# EAGLE schematic UPS (EAGLE 9.4.2)
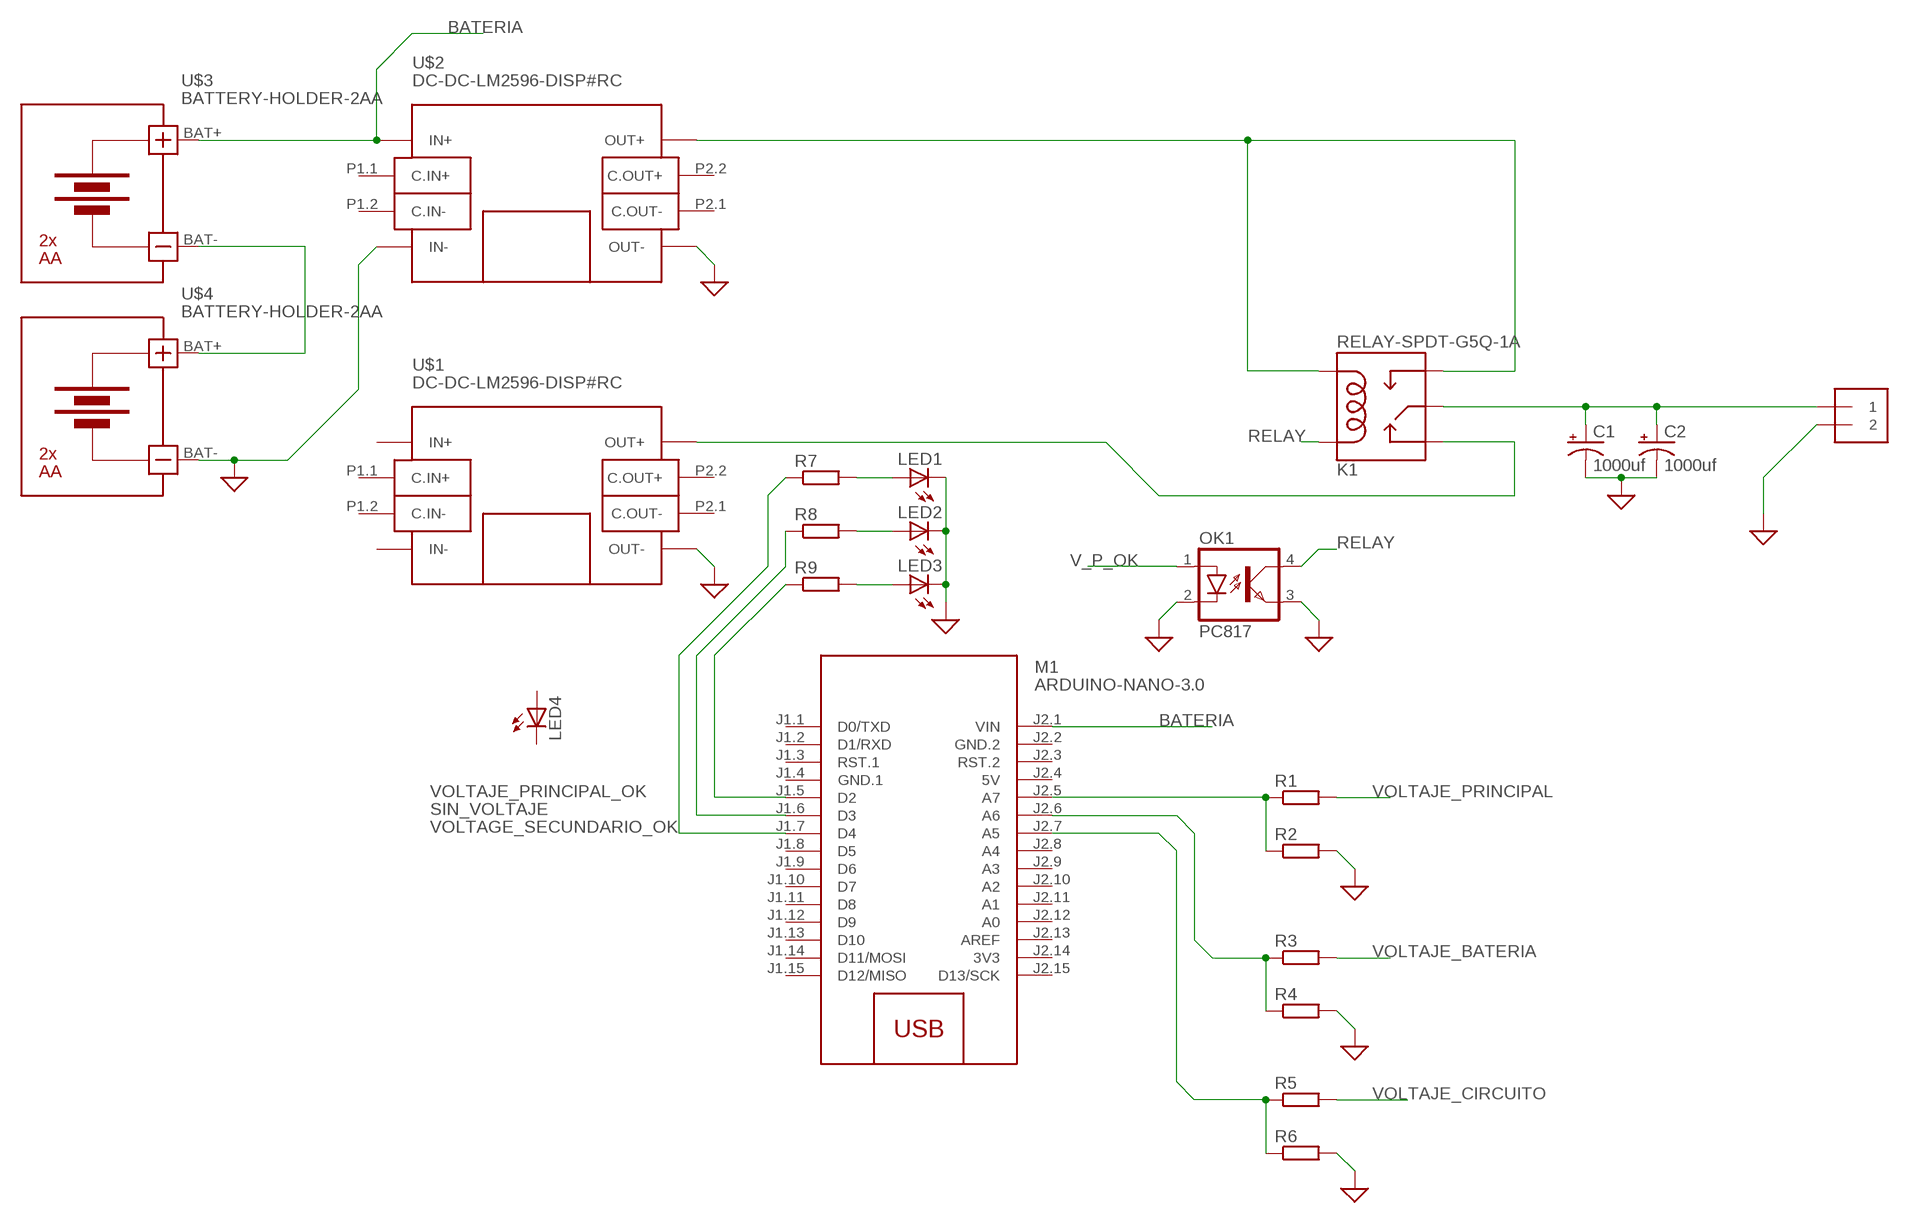
[diagram p0: schematic, sheet 1]

## Parts
C1  1000uf  1000UF-RADIAL-5MM-25V-20%  [CPOL-RADIAL-5MM-10MM]
C2  1000uf  1000UF-RADIAL-5MM-25V-20%  [CPOL-RADIAL-5MM-10MM]
J1  1X2-3.5MM  [1X2-3.5MM]
K1  RELAY-SPDT-G5Q-1A  [RELAY-G5Q]
LED1  LED5MM  [LED5MM]
LED2  LED5MM  [LED5MM]
LED3  LED5MM  [LED5MM]
LED4  LED5MM  [LED5MM]
M1  ARDUINO-NANO-3.0  [ARDUINO-NANO-3.0]
OK1  PC817  [DIL04]
R1  R-EU_0207/10  [0207/10]
R2  R-EU_0207/10  [0207/10]
R3  R-EU_0207/10  [0207/10]
R4  R-EU_0207/10  [0207/10]
R5  R-EU_0207/10  [0207/10]
R6  R-EU_0207/10  [0207/10]
R7  R-EU_0207/10  [0207/10]
R8  R-EU_0207/10  [0207/10]
R9  R-EU_0207/10  [0207/10]
U$1  DC-DC-LM2596-DISP#RC  [DC-DC-LM2596-DISP#RC]
U$2  DC-DC-LM2596-DISP#RC  [DC-DC-LM2596-DISP#RC]
U$3  BATTERY-HOLDER-2AA  [BATTERY-HOLDER-2AA]
U$4  BATTERY-HOLDER-2AA  [BATTERY-HOLDER-2AA]

## Nets
BATERIA: M1.J2.1(VIN) U$2.IN+ U$3.BAT+
GND: C1.- C2.- J1.2 LED1.K(C) LED2.K(C) LED3.K(C) OK1.2(C) OK1.3(EMIT) R2.2 R4.2 R6.2 U$1.OUT- U$2.IN- U$2.OUT- U$4.BAT- ; supply symbol labelled SUP
N$1: M1.J2.5(A7) R1.1 R2.1
N$2: M1.J2.6(A6) R3.1 R4.1
N$3: M1.J2.7(A5) R5.1 R6.1
N$4: U$3.BAT- U$4.BAT+
N$5: K1.4(NC) U$1.OUT+
N$6: C1.+ C2.+ J1.1 K1.2(MAIN)
N$8: LED1.A R7.2
N$9: LED2.A R8.2
N$10: LED3.A R9.2
N$11: K1.1(COIL2) K1.3(NO) U$2.OUT+
RELAY: K1.5(COIL1) OK1.4(COL)
SIN_VOLTAJE: M1.J1.6(D3) R8.1
V_P_OK: OK1.1(A)
VOLTAGE_SECUNDARIO_OK: M1.J1.7(D4) R7.1
VOLTAJE_BATERIA: R3.2
VOLTAJE_CIRCUITO: R5.2
VOLTAJE_PRINCIPAL: R1.2
VOLTAJE_PRINCIPAL_OK: M1.J1.5(D2) R9.1
Unconnected: LED4.A LED4.K(C) M1.J1.1(D0/TXD) M1.J1.2(D1/RXD) M1.J1.3(RST.1) M1.J1.8(D5) M1.J1.9(D6) M1.J1.10(D7) M1.J1.11(D8) M1.J1.12(D9) M1.J1.13(D10) M1.J1.14(D11/MOSI) M1.J1.15(D12/MISO) M1.J2.3(RST.2) M1.J2.8(A4) M1.J2.9(A3) M1.J2.10(A2) M1.J2.11(A1) M1.J2.12(A0) M1.J2.13(AREF) M1.J2.15(D13/SCK) U$1.IN+ U$1.IN- U$1.P1.1(C.IN+) U$1.P1.2(C.IN-) U$1.P2.1(C.OUT-) U$1.P2.2(C.OUT+) U$2.P1.1(C.IN+) U$2.P1.2(C.IN-) U$2.P2.1(C.OUT-) U$2.P2.2(C.OUT+)

## Power pins joined to a net without a drawn wire
3V3: M1.J2.14(3V3)
5V: M1.J2.4(5V)
GND.1: M1.J1.4(GND.1)
GND.2: M1.J2.2(GND.2)

## Library data of the parts
C1 C2 = SparkFun-Capacitors:1000UF: 1,000µF/1mF ceramic capacitors A capacitor is a passive two-terminal electrical component used to store electrical energy temporarily in an electric field. CAP-08070; PROD_ID: CAP-09538; VALUE: 1mF
J1 = adafruit:1X2: 3.5mm Terminal block http://www.ladyada.net/library/pcb/eaglelibrary.html
K1 = SparkFun-Retired:RELAY-SPDT: SPDT relay (COM-00101)
LED1-LED4 = adafruit:LED: LED OSRAM: - CHIPLED LG R971, LG N971, LY N971, LG Q971, LY Q971, LO R971, LY R971 LH N974, LH R974 LS Q976, LO Q976, LY Q976 LO Q996 - Hyper CHIPLED LW Q18S LB Q993, LB Q99A, LB R99A - SideLED LS A670, LO A670, LY A670, LG A670, LP A670 LB A673, LV A673, LT A673, LW A673 LH A674 LY A675 LS A676, LA A676, LO A676, LY A676, LW A676 LS A679, LY A679, LG A679 - Hyper Micro SIDELED® LS Y876, LA Y876, LO Y876, LY Y876 LT Y87S - SmartLED LW L88C, LW L88S LB L89C, LB L89S, LG L890 LS L89K, LO L89K, LY L89K LS L896, LA L896, LO L896, LY L896 - TOPLED LS T670, LO T670, LY T670, LG T670, LP T670 LSG T670, LSP T670, LSY T670, LOP T670, LYG T670 LG T671, LOG T671, LSG T671 LB T673, LV T673, LT T673, LW T673 LH T674 LS T676, LA T676, LO T676, LY T676, LB T676, LH T676, LSB T676, LW T676 LB T67C, LV T67C, LT T67C, LS T67K, LO T67K, LY T67K, LW E67C LS E67B, LA E67B, LO E67B, LY E67B, LB E67C, LV E67C, LT E67C LW T67C LS T679, LY T679, LG T679 LS T770, LO T770, LY T770, LG T770, LP T770 LB T773, LV T773, LT T773, LW T773 LH T774 LS E675, LA E675, LY E675, LS T675 LS T776, LA T776, LO T776, LY T776, LB T776 LHGB T686 LT T68C, LB T68C - Hyper Mini TOPLED® LB M676 - Mini TOPLED Santana® LG M470 LS M47K, LO M47K, LY M47K Source: http://www.osram.convergy.de/
M1 = diy-modules:ARDUINO-NANO-3.0: Arduino Nano 3.0
OK1 = optocoupler:PC817: SHARP OPTO COUPLER; MPN: PC817X4J000F; OC_FARNELL: 9707727; OC_NEWARK: 97K7059
R1-R9 = rcl:R-EU_: RESISTOR, European symbol; SPICEPREFIX: R
U$1 U$2 = diy-modules(1):DC-DC-LM2596-DISP#RC: DC/DC Step-Down Regulator with Voltage Display based on LM2596-ADJ chip Symbol with input and output connectors More details available here: http://www.instructables.com/id/The-Introduction-of-LM2596-Step-Down-Power-Module-/ LM2596 datasheet available here: http://www.ti.com/lit/ds/symlink/lm2596.pdf Click here to find device on ebay.com <http://www.ebay.com/sch/lm2596+led+voltmeter+40>
U$3 U$4 = diy-modules(1):BATTERY-HOLDER-2AA: Battery Holder 2 x AA Click here to find device on ebay.com <http://www.ebay.com/sch/battery+plastic+holder+aa+2x1.5v>